# Altium schematic sheet Eeprom.SchDoc
size A4; DocumentNumber: 15; SheetNumber: 15; SheetTotal: 15
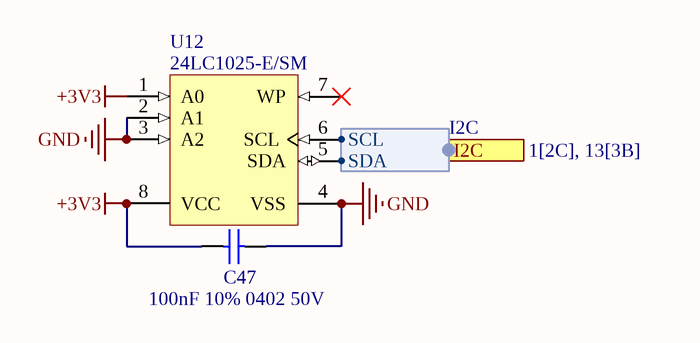
[diagram p0: Eeprom.SchDoc]

## Parts
C47  100nF 10% 0402 50V  [0402N]
U12  24LC1025-E/SM  [SOIJ-SM8_N]

## Ports
I2C (harness I2C, see 1[2C], 13[3B])

## Harnesses
I2C: SDA, SCL

## Nets
+3V3: C47.2 U12.1(A0) U12.8(VCC)
GND: C47.1 U12.2(A1) U12.3(A2) U12.4(VSS)
NetU12_5: U12.5(SDA) ; port I2C.SDA
NetU12_6: U12.6(SCL) ; port I2C.SCL

Not connected (* = marked no-connect by the designer): U12 7(WP)*

## Library data of the parts
C47 = C0402: Capacitance: 100n; Tolerance: 10; Voltage: 50; Footprint: 0402
U12 = CMP-0159-00568-1: 1 Mbit, 400kHz, 2.5V, I2C Serial EEPROM, 8-Pin SOIC 208mil, Extended Temperature; PackageReference: SOIJ-SM8; PackageDescription: 8-Lead Plastic Small Outline (SM) - Medium, 5.28 mm Body [SOIJ]; DatasheetVersion: revF, Oct-2008; PackageVersion: revBB, Aug-2009